# Altium schematic sheet [1] - COVER PAGE.SchDoc
size A3; DocumentNumber: 1; SheetNumber: 1; SheetTotal: 6
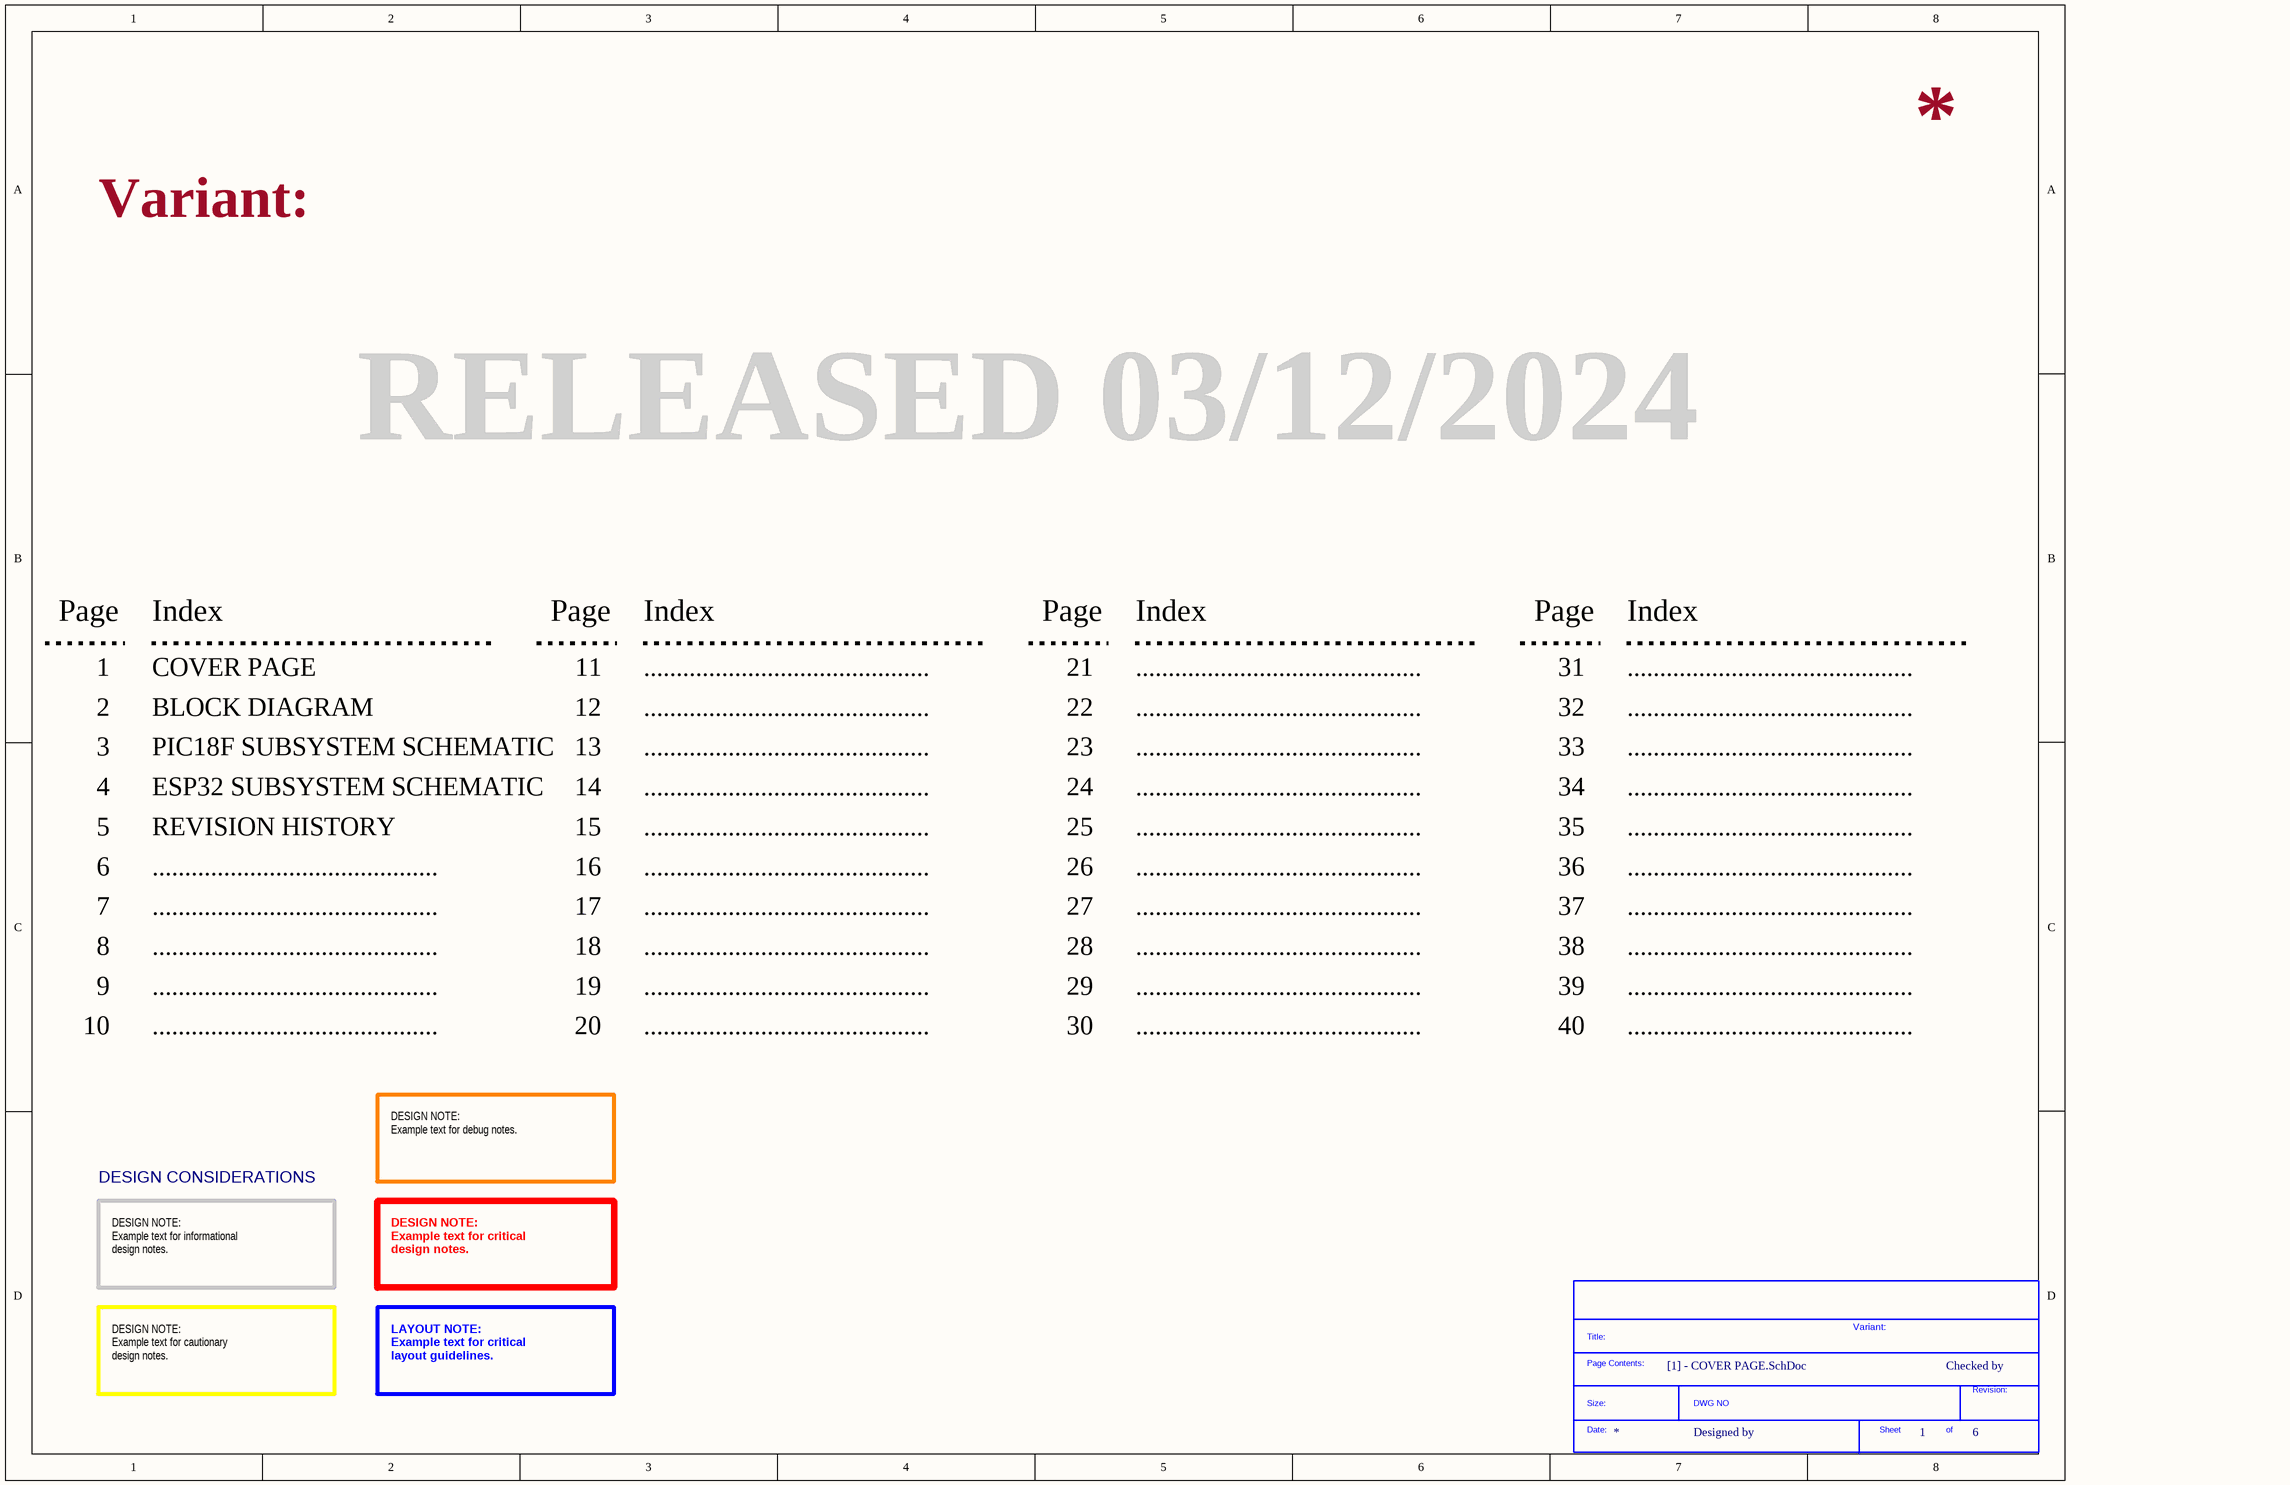
[diagram p0: [1] - COVER PAGE.SchDoc]

## Parts
*  SDTitleBlock  (value not drawn)  (graphical)

## Notes on the sheet
- Variant:
- RELEASED 03/12/2024
- Page
- Index
- 1
- COVER PAGE
- 11
- ............................................
- 21
- 31
- 2
- 3
- BLOCK DIAGRAM
- PIC18F SUBSYSTEM SCHEMATIC
- 12
- 13
- 22
- 23
- 32
- 33
- 4
- 5
- REVISION HISTORY
- ESP32 SUBSYSTEM SCHEMATIC
- 14
- 15
- 24
- 25
- 34
- 35
- 6
- 16
- 26
- 36
- 7
- 8
- 17
- 18
- 27
- 28
- 37
- 38
- 9
- 10
- 19
- 20
- 29
- 30
- 39
- 40
- DESIGN NOTE:
  Example text for debug notes.
- DESIGN CONSIDERATIONS
- DESIGN NOTE:
  Example text for informational
  design notes.
- DESIGN NOTE:
  Example text for critical
  design notes.
- Checked by
- DESIGN NOTE:
  Example text for cautionary
  design notes.
- LAYOUT NOTE:
  Example text for critical
  layout guidelines.
- Designed by
- (in symbol SDTitleBlock) Title:; Page Contents:; Revision:; Size:; DWG NO; Date:; Sheet; of